# Altium schematic sheet Connector 1.SchDoc
size A4; SheetNumber: 6; SheetTotal: 12
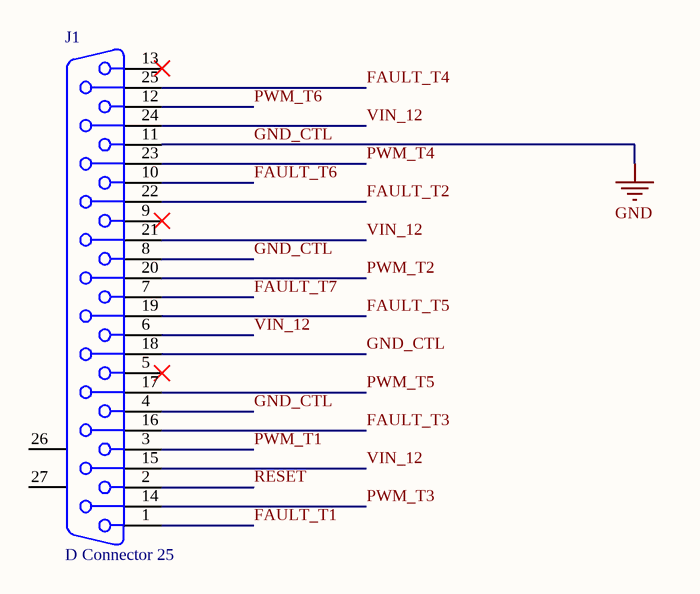
[diagram p0: Connector 1.SchDoc]

## Parts
J1  D Connector 25  [DSUB1.385-2H25A]

## Nets
GND_CTL: J1.4 J1.8 J1.11 J1.18  [also labelled GND]
FAULT_T1: J1.1
FAULT_T2: J1.22
FAULT_T3: J1.16
FAULT_T4: J1.25
FAULT_T5: J1.19
FAULT_T6: J1.10
FAULT_T7: J1.7
PWM_T1: J1.3
PWM_T2: J1.20
PWM_T3: J1.14
PWM_T4: J1.23
PWM_T5: J1.17
PWM_T6: J1.12
RESET: J1.2
VIN_12: J1.6 J1.15 J1.21 J1.24

Not connected (* = marked no-connect by the designer): J1 5* 9* 13* 26(MH1) 27(MH2)

## Library data of the parts
J1 = D Connector 25: Receptacle Assembly, 25 Position, Right Angle; PackageDocument: U; Positions: 25; Published: 15-Jun-2001; LatestRevisionDate: 17-Jul-2002; LatestRevisionNote: Re-released for DXP Platform.; DatasheetDocument: 19-Mar-1999; PackageReference: 787202; Publisher: Altium Limited; Orientation: Right Angle; Gender: Receptacle